# Altium project Yukitora_Mezanine.PrjPcb
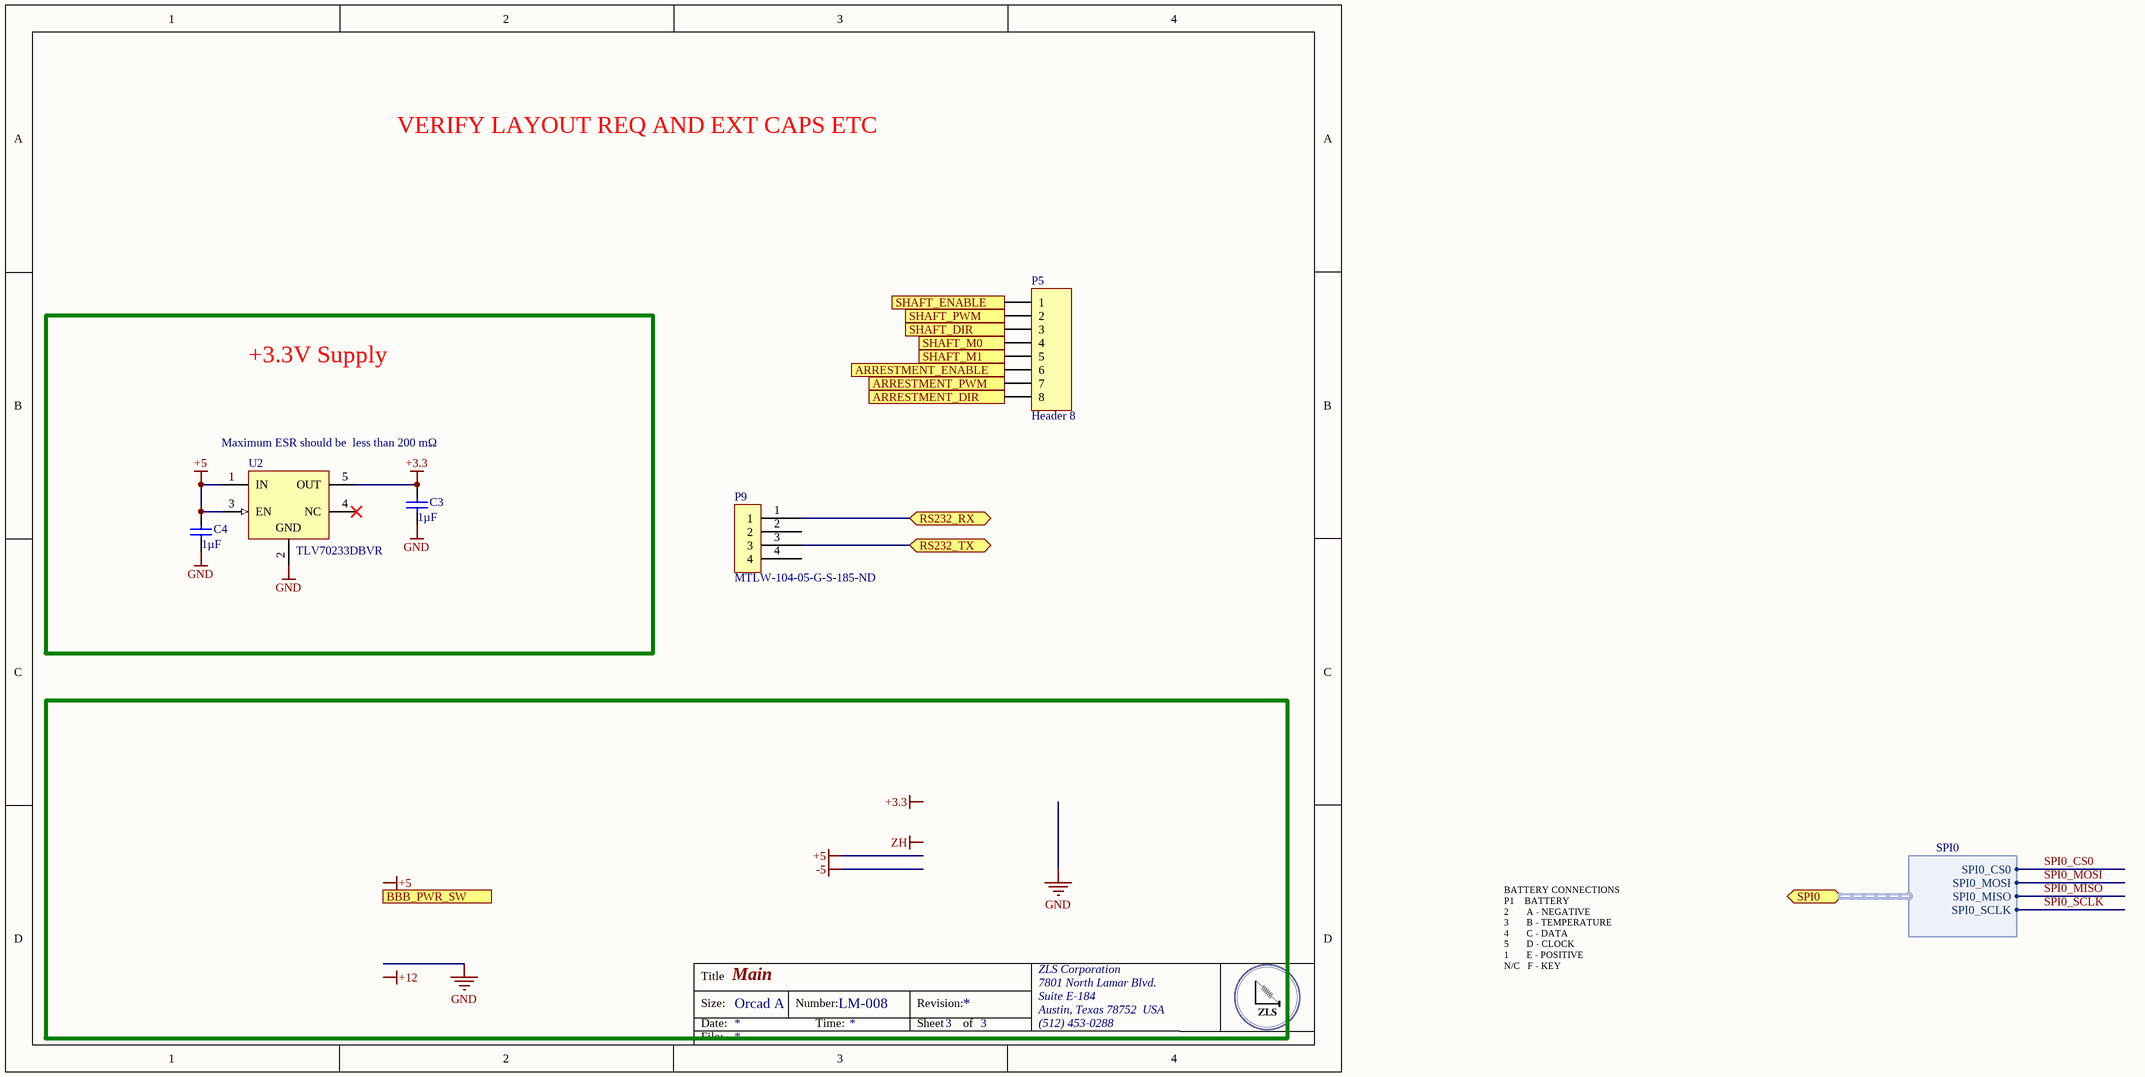
[diagram p0: Connectors.SchDoc]
6 sheets, 71 parts. Net scope: flat (ports and power ports of the same name join across sheets).
Board file: Yukitora_Mezanine.PcbDoc
Sheets:
  Connectors.SchDoc
  12_Supply.SchDoc
  Power_Input_FET.SchDoc
  5V_Supply_Alt_1.SchDoc
  Bluetooth.SchDoc
  Stepper Motor Driver.SchDoc

## Sheet Connectors.SchDoc: Main
size OrCAD A; DocumentNumber: LM-008; SheetNumber: 3; SheetTotal: 3; DocumentName: LM-008

### Parts
C3  Capacitance: 1µF  [CAPC1206(3216)130_N]  (hidden comment: CAP CER 1UF 50V X7R 1210)
C4  Capacitance: 1µF  [CAPC1206(3216)130_N]  (hidden comment: CAP CER 1UF 50V X7R 1210)
P5  Header 8  [HDR1X8]
P9  Supplier Part Number 1: MTLW-104-05-G-S-185-ND  [TLW-104-05-G-S]  (hidden comment: TLW-104-05-G-S)
U2  TLV70233DBVR  [DBV0005A_N]

### Blocks framed on the sheet
+3.3V Supply: C3 C4 U2

### Ports
ARRESTMENT_DIR, ARRESTMENT_ENABLE, ARRESTMENT_PWM, BBB_PWR_SW, RS232_RX, RS232_TX, SHAFT_DIR, SHAFT_ENABLE, SHAFT_M0, SHAFT_M1, SHAFT_PWM, SPI0 (harness SPI0)

### Harnesses
SPI0: SPI0_CS0, SPI0_MOSI, SPI0_MISO, SPI0_SCLK

### Nets
+3.3: C3.2 U2.5(OUT)
+5: C4.2 U2.1(IN) U2.3(EN)
GND: C3.1 C4.1 U2.2(GND)
RS232_RX: P9.1 ; port RS232_RX
RS232_TX: P9.3 ; port RS232_TX
SPI0_CS0: port SPI0.SPI0_CS0
SPI0_MISO: port SPI0.SPI0_MISO
SPI0_MOSI: port SPI0.SPI0_MOSI
SPI0_SCLK: port SPI0.SPI0_SCLK
NetP5_1: P5.1 ; port SHAFT_ENABLE
NetP5_2: P5.2 ; port SHAFT_PWM
NetP5_3: P5.3 ; port SHAFT_DIR
NetP5_4: P5.4 ; port SHAFT_M0
NetP5_5: P5.5 ; port SHAFT_M1
NetP5_6: P5.6 ; port ARRESTMENT_ENABLE
NetP5_7: P5.7 ; port ARRESTMENT_PWM
NetP5_8: P5.8 ; port ARRESTMENT_DIR

Not connected (* = marked no-connect by the designer): P9 2 4; U2 4(NC)*

### Notes on the sheet
- VERIFY LAYOUT REQ AND EXT CAPS ETC
- Maximum ESR should be  less than 200 mΩ
- BATTERY CONNECTIONS
  P1    BATTERY
  2       A - NEGATIVE
  3       B - TEMPERATURE
  4       C - DATA
  5       D - CLOCK
  1       E - POSITIVE
  N/C   F - KEY
- Labels drawn without touching a wire or pin: +3.3, +5, +12, ZH
- Title
- Size:
- Date:
- Orcad A
- Number:
- Time:
- Revision:
- Sheet
- of
- ZLS Corporation
- 7801 North Lamar Blvd.
- Suite E-184
- Austin, Texas 78752  USA
- (512) 453-0288
- File:

### Library data of the parts
C3 C4 = CMP-1037-04913-1: Manufacturer: Murata Electronics North America; Manufacturer Part Number: GRM32RR71H105KA01L; Tolerance: ±10%; Supplier 1: Digi-Key; Supplier Part Number 1: 490-1863-6-ND; RoHS: RoHS Compliant; Category: Capacitors; Stock 1: 66890; Pricing 1: 1=0.35, 10=0.242, 100=0.1449, 500=0.10868 (USD); Packaging: Digi-Reel®; Part Status: Active; Voltage - Rated: 50V; Temperature Coefficient: X7R; Operating Temperature: -55°C ~ 125°C; Features: -; Ratings: -; Applications: General Purpose; Mounting Type: Surface Mount, MLCC; Package / Case: 1210 (3225 Metric); Size / Dimension: 0.126" L x 0.098" W (3.20mm x 2.50mm); Height - Seated (Max): -; Thickness (Max): 0.079" (2.00mm); Lead Spacing: -; Lead Style: -; ComponentLink1URL: http://search.murata.co.jp/Ceramy/image/img/A01X/G101/ENG/GRM32RR71H105KA01-01.pdf; ComponentLink1Description: http://search.murata.co.jp/Ceramy/image/img/A01X/G101/ENG/GRM32RR71H105KA01-01.pdf
P5 = Header 8: Header, 8-Pin; LatestRevisionDate: 17-Jul-2002; LatestRevisionNote: Re-released for DXP Platform.; Publisher: Altium Limited
U2 = CMP-0394-00528-2: Single Output LDO, 300 mA, Fixed 3.3 V Output, 2 to 5.5 V Input, with Low IQ, 5-pin SOT-23 (DBV), -40 to 125 degC, Green (RoHS & no Sb/Br); Manufacturer: Texas Instruments; Vout Adj(Max)(V): 3.3; Vin(Max)(V): 5.5; SubFamily: Single Channel LDO; Iq(Typ)(mA): 0.03; Iout(Max)(A): 0.3; Vin(Min)(V): 2; Vdo(Typ)(mV): 220; Vout Adj(Min)(V): 3.3; Eco-Plan: Green (RoHS & no Sb/Br); PackageVersion: 4073253-4/K; ComponentLink1Description: Manufacturer URL; DatasheetVersion: SLVSAG6B; ComponentLink2Description: Datasheet; ComponentLink3URL: http://www.ti.com/litv/pdf/mpds018i; ComponentLink2URL: http://www.ti.com/general/docs/lit/getliterature.tsp?genericPartNumber=TLV70233&fileType=pdf; PackageReference: DBV0005A; ComponentLink1URL: http://www.ti.com/; Mounting Technology: Surface Mount; ComponentLink3Description: Package Specification; PackageDescription: 5-Pin Plastic Small Outline, Body 1.60 Ãƒâ€” 2.90 mm, Pitch 0.95 mm; Code_JEDEC: MO-178; Fixed Output Options(V): 3.3; PartNumber: TLV70233DBVR; Accuracy(%): 2
P9 = TLW-104-05-G-S: Supplier 1: Digi-Key

## Sheet 12_Supply.SchDoc: 12V Supply
size OrCAD A; DocumentNumber: YT-002; Revision: -
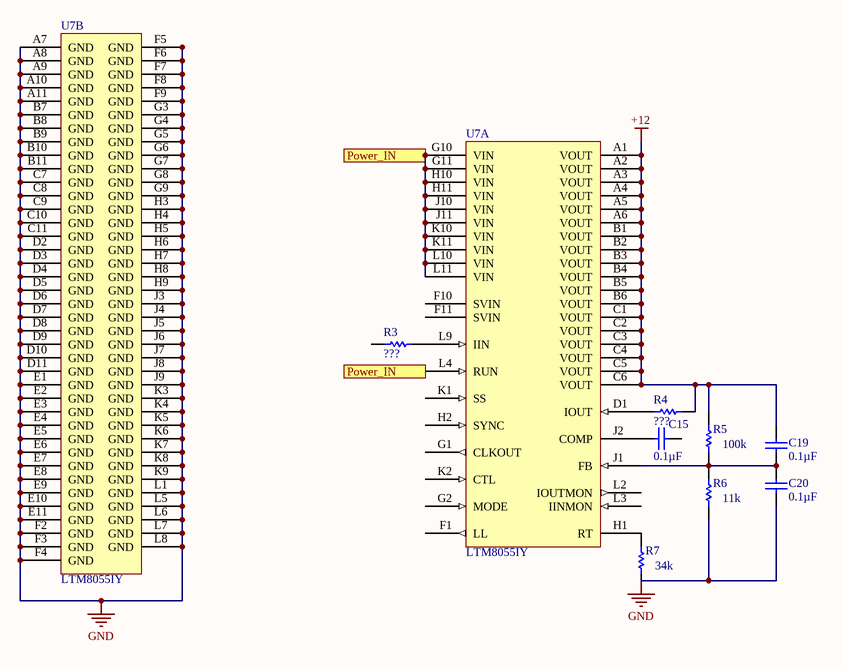
[diagram p1: 12_Supply.SchDoc]

### Parts
C15  Capacitance: 0.1µF  [CAPC0805(2012)145_N]  (hidden comment: CAP CER 0.1UF 16V X7R 0805)
C19  Capacitance: 0.1µF  [CAPC0805(2012)145_N]  (hidden comment: CAP CER 0.1UF 16V X7R 0805)
C20  Capacitance: 0.1µF  [CAPC0805(2012)145_N]  (hidden comment: CAP CER 0.1UF 16V X7R 0805)
R3  ???  [RESC0402(1005)_L]
R4  ???  [RESC0402(1005)_L]
R5  100k  [RESC0402(1005)_L]
R6  11k  [RESC0402(1005)_L]
R7  34k  [RESC0402(1005)_L]
U7  LTM8055IY  [LT-BGA-121-15000X15000X4920]  (parts A,B of 2)

### Ports
Power_IN

### Nets
+12: C19.2 R4.1 R5.2 U7.A1(VOUT) U7.A2(VOUT) U7.A3(VOUT) U7.A4(VOUT) U7.A5(VOUT) U7.A6(VOUT) U7.B1(VOUT) U7.B2(VOUT) U7.B3(VOUT) U7.B4(VOUT) U7.B5(VOUT) U7.B6(VOUT) U7.C1(VOUT) U7.C2(VOUT) U7.C3(VOUT) U7.C4(VOUT) U7.C5(VOUT) U7.C6(VOUT)
GND: C20.1 R6.1 U7.A7(GND) U7.A8(GND) U7.A9(GND) U7.A10(GND) U7.A11(GND) U7.B7(GND) U7.B8(GND) U7.B9(GND) U7.B10(GND) U7.B11(GND) U7.C7(GND) U7.C8(GND) U7.C9(GND) U7.C10(GND) U7.C11(GND) U7.D2(GND) U7.D3(GND) U7.D4(GND) U7.D5(GND) U7.D6(GND) U7.D7(GND) U7.D8(GND) U7.D9(GND) U7.D10(GND) U7.D11(GND) U7.E1(GND) U7.E2(GND) U7.E3(GND) U7.E4(GND) U7.E5(GND) U7.E6(GND) U7.E7(GND) U7.E8(GND) U7.E9(GND) U7.E10(GND) U7.E11(GND) U7.F2(GND) U7.F3(GND) U7.F4(GND) U7.F5(GND) U7.F6(GND) U7.F7(GND) U7.F8(GND) U7.F9(GND) U7.G3(GND) U7.G4(GND) U7.G5(GND) U7.G6(GND) U7.G7(GND) U7.G8(GND) U7.G9(GND) U7.H3(GND) U7.H4(GND) U7.H5(GND) U7.H6(GND) U7.H7(GND) U7.H8(GND) U7.H9(GND) U7.J3(GND) U7.J4(GND) U7.J5(GND) U7.J6(GND) U7.J7(GND) U7.J8(GND) U7.J9(GND) U7.K3(GND) U7.K4(GND) U7.K5(GND) U7.K6(GND) U7.K7(GND) U7.K8(GND) U7.K9(GND) U7.L1(GND) U7.L5(GND) U7.L6(GND) U7.L7(GND) U7.L8(GND)
Power_IN: U7.G10(VIN) U7.G11(VIN) U7.H10(VIN) U7.H11(VIN) U7.J10(VIN) U7.J11(VIN) U7.K10(VIN) U7.K11(VIN) U7.L4(RUN) U7.L10(VIN) U7.L11(VIN) ; port Power_IN
NetC15_1: C15.1 U7.J2(COMP)
NetC19_1: C19.1 C20.2 R5.1 R6.2 U7.J1(FB)
NetR3_1: R3.1 U7.L9(IIN)
NetR4_2: R4.2 U7.D1(IOUT)
NetR7_2: R7.2 U7.H1(RT)

Not connected (* = marked no-connect by the designer): C15 2; R3 2; R7 1; U7 F1(LL) F10(SVIN) F11(SVIN) G1(CLKOUT) G2(MODE) H2(SYNC) K1(SS) K2(CTL) L2(IOUTMON) L3(IINMON)

### Notes on the sheet
- Title
- Size:
- Date:
- Orcad A
- Number:
- Time:
- Revision:
- Sheet
- of
- ZLS Corporation
- 7801 North Lamar Blvd.
- Suite E-184
- Austin, Texas 78752  USA
- (512) 453-0288
- File:

### Library data of the parts
C15 C19 C20 = CMP-1036-04795-1: Manufacturer: Murata Electronics North America; Manufacturer Part Number: GRM219R71C104KA01D; Tolerance: ±10%; Voltage - Rated: 25V; Supplier Part Number 1: 490-1673-6-ND; Temperature Coefficient: X7R; Thickness (Max): 0.053" (1.35mm); Supplier 2: Digi-Key; Supplier Part Number 2: 490-1683-6-ND; RoHS: RoHS Compliant; Category: Capacitors; Stock 2: 245331; Pricing 2: 1=0.14, 10=0.098, 100=0.0462, 500=0.0324, 1000=0.02683 (USD); Packaging: Digi-Reel®; Part Status: Active; Operating Temperature: -55°C ~ 125°C; Features: -; Ratings: -; Applications: General Purpose; Mounting Type: Surface Mount, MLCC; Package / Case: 0805 (2012 Metric); Size / Dimension: 0.079" L x 0.049" W (2.00mm x 1.25mm); Height - Seated (Max): -; Lead Spacing: -; Lead Style: -; ComponentLink1URL: http://www.murata.com/~/media/webrenewal/support/library/catalog/products/capacitor/mlcc/c02e.ashx; ComponentLink1Description: http://www.murata.com/~/media/webrenewal/support/library/catalog/products/capacitor/mlcc/c02e.ashx
R3-R7 = CMP-1011-00927-1: Tolerance: ±1%; Temperature Coefficient: ±100ppm/°C; Supplier Part Number 1: YAG3220CT-ND; Supplier Device Package: 0402
U7 = CMP-2000-06614-1: Buck-Boost uModule Regulator, 8.5 A, 5 to 36 V, -40 to 125 degC, 121-Ball BGA, RoHS, Tray; Manufacturer: LinearTechnology; Current - Output (Max): 8.5A; Number of Outputs: 1; Efficiency: 97.5%; Voltage - Input (Max): 36V; Package Version: Rev. A, 11/2012; Voltage - Output 1: 1.2~36V; Voltage - Input (Min): 5V; Operating Temperature: -40°C~125°C; Voltage - Output 3: -; Datasheet Version: Rev. A, 01/2016; Power (Watts) - Manufacture Series: -; Series: µModule®; Manufacturer URL: http://www.linear.com/; Datasheet URL: http://cds.linear.com/docs/en/datasheet/8055fa.pdf; Type: Non-IsolatedPoLModule; Voltage - Output 2: -; Mounting Type: SurfaceMount; Packaging: Tray; Mounting Technology: SurfaceMount; Package URL: http://www.linear.com/docs/41075; Features: OTP; Power (Watts) - Max: -; Package Reference: BGA-121; Category: PowerSupplies-BoardMount; Package / Case: 121-BGA; Voltage - Isolation: -; Package Description: 121-Ball BGA, Body 15 x 15 mm, Pitch 1.27 mm; Applications: ITE(Commercial); Family: DCDCConverters; PartId: 1

## Sheet Power_Input_FET.SchDoc: Power Input
size OrCAD A; CompanyName: ZLS; DocumentNumber: LM-008; Revision: F
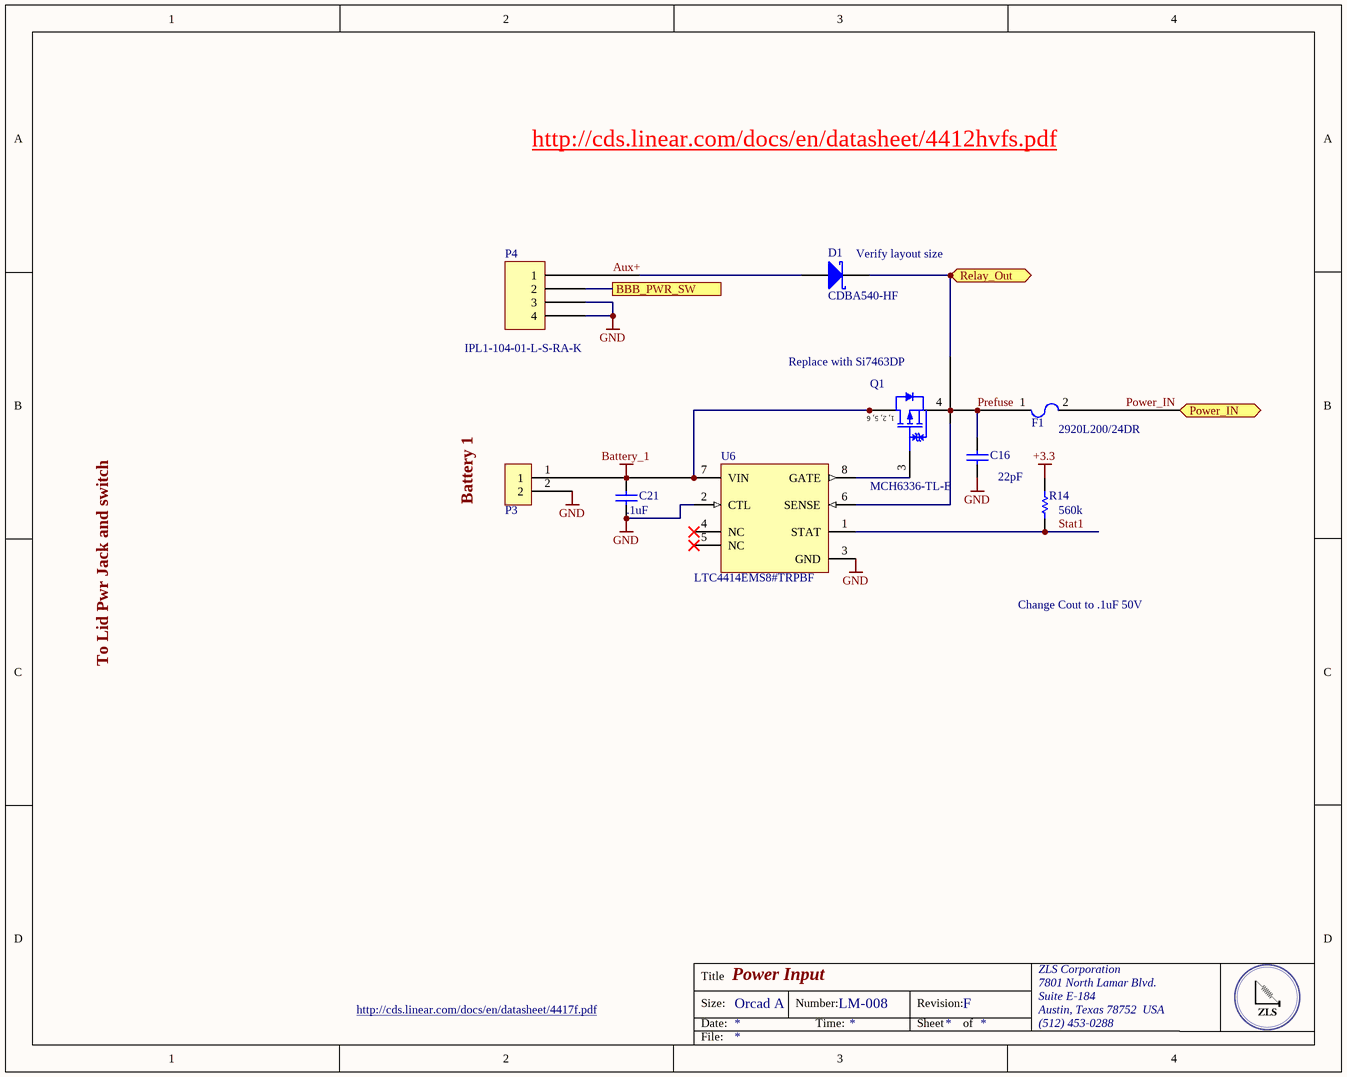
[diagram p2: Power_Input_FET.SchDoc]

### Parts
C16  Capacitance: 22pF  [CAPC1206(3216)130_N]  (hidden comment: CAP CER 10UF 6.3V X5R 1206)
C21  Capacitance: .1uF  [CAPC1206(3216)130_N]  (hidden comment: CAP CER 10UF 6.3V X5R 1206)
D1  CDBA540-HF  [VISH-DO-214AC-2_M]
F1  PCT  [CAPC7451X12N]  (value not drawn)
P3  IPL1-102-01-F-S-RA-K  [IPL1-102-01-F-S-RA-K]  (value not drawn)
P4  IPL1-104-01-L-S-RA-K  [IPL1-104-01-L-S-RA-K]
Q1  MCH6336-TL-E  [ONSC-MCPH-6_V]
R14  560k  [RESC0402(1005)_L]
U6  LTC4414EMS8#TRPBF  [LT-MS8-8_L]

### Ports
BBB_PWR_SW, Power_IN, Relay_Out

### Nets
+3.3: R14.2
Battery_1: C21.2 P3.1 Q1.1(D) Q1.2(D) Q1.5(D) Q1.6(D) U6.7(VIN)
GND: C16.1 C21.1 P3.2 P4.3 P4.4 U6.2(CTL) U6.3(GND)
Aux+: D1.1(A) P4.1
Power_IN: F1.2 ; port Power_IN
Prefuse: C16.2 D1.2(K) F1.1 Q1.4(S) U6.6(SENSE) ; port Relay_Out
Stat1: R14.1 U6.1(STAT)
NetP4_2: P4.2 ; port BBB_PWR_SW
NetQ1_3: Q1.3(G) U6.8(GATE)

Not connected (* = marked no-connect by the designer): U6 4(NC)* 5(NC)*

### Notes on the sheet
- http://cds.linear.com/docs/en/datasheet/4412hvfs.pdf
- (near D1) Verify layout size
- (near Q1) Replace with Si7463DP
- (near F1) 2920L200/24DR
- Battery 1
- Change Cout to .1uF 50V
- To Lid Pwr Jack and switch
- http://cds.linear.com/docs/en/datasheet/4417f.pdf
- Title
- Size:
- Date:
- Orcad A
- Number:
- Time:
- Revision:
- Sheet
- of
- ZLS Corporation
- 7801 North Lamar Blvd.
- Suite E-184
- Austin, Texas 78752  USA
- (512) 453-0288
- File:
- (in symbol CMP-1058-00598-1) 1, 2, 5, 6

### Library data of the parts
C16 C21 = CMP-1037-04913-1: Manufacturer: Taiyo Yuden; Manufacturer Part Number: JMK316BJ106ML-T; Tolerance: ±20%; Notification: Current market demand for these product types have resulted in fluctuating and extending lead times. Lead times may differ.; Supplier 1: Digi-Key; Supplier Part Number 1: 587-5447-1-ND; RoHS: RoHS Compliant; Category: Capacitors; Stock 1: 5600; Pricing 1: 1=0.24, 10=0.161, 100=0.0817, 500=0.05592, 1000=0.04946 (USD); Packaging: Cut Tape (CT); Part Status: Active; Voltage - Rated: 6.3V; Temperature Coefficient: X5R; Operating Temperature: -55°C ~ 85°C; Features: -; Ratings: -; Applications: SMPS Filtering; Failure Rate: -; Mounting Type: Surface Mount, MLCC; Package / Case: 1206 (3216 Metric); Size / Dimension: 0.126" L x 0.063" W (3.20mm x 1.60mm); Height - Seated (Max): -; Thickness (Max): 0.071" (1.80mm); Lead Spacing: -; Lead Style: -; ComponentLink1URL: http://ds.yuden.co.jp/TYCOMPAS/ut/detail.do?productNo=JMK316BJ106ML-T&fileName=JMK316BJ106ML-T_SS&mode=specSheetDownload; ComponentLink1Description: http://ds.yuden.co.jp/TYCOMPAS/ut/detail.do?productNo=JMK316BJ106ML-T&fileName=JMK316BJ106ML-T_SS&mode=specSheetDownload
D1 = D Schottky: DIODE SCHOTTKY 40V 5A DO214AB; Manufacturer: Comchip Technology; Speed: Fast Recovery =< 500ns, > 200mA (Io); Capacitance @ Vr, F: 380pF @ 4V, 1MHz; Supplier 1: Digi-Key; Supplier Part Number 1: 641-1707-6-ND; Manufacturer Part Number: CDBA540-HF; RoHS: RoHS Compliant; Category: Discrete Semiconductor Products; Stock 1: 7367; Pricing 1: 1=0.49, 10=0.381, 25=0.3208, 100=0.2612, 250=0.2164, 500=0.1791, 1000=0.13432, 2500=0.12313 (USD); Packaging: Digi-Reel®; Part Status: Active; Diode Type: Schottky; Current - Average Rectified (Io): 5A; Mounting Type: Surface Mount; Package / Case: DO-214AC, SMA; Supplier Device Package: DO-214AC (SMA); Operating Temperature - Junction: -50°C ~ 150°C; ComponentLink1URL: http://www.comchiptech.com/cms/UserFiles/CDBA540-HF%20Thru505315.%20CDBA5200-HF%20RevC.pdf; ComponentLink1Description: http://www.comchiptech.com/cms/UserFiles/CDBA540-HF%20Thru505315.%20CDBA5200-HF%20RevC.pdf
P4 = IPL1-104-01-L-S-RA-K: Manufacturer: Samtec Inc.; Connector Type: Header; Pitch - Mating: 0.100" (2.54mm); Number of Positions: 4; Number of Positions Loaded: All; Style: Board to Cable/Wire; Shrouding: Shrouded - 4 Wall; Contact Length - Mating: 0.215" (5.46mm); Contact Length - Post: 0.085" (2.16mm); Material Flammability Rating: UL94 V-0; Voltage Rating: 675VAC, 954VDC; Supplier 1: Digi-Key; Supplier Part Number 1: SAM9597-ND; Manufacturer Part Number: IPL1-104-01-L-S-RA-K; RoHS: RoHS Compliant; Category: Connectors, Interconnects; Stock 1: 265; Pricing 1: 1=2.53, 10=2.424, 100=2.02, 500=1.717, 1000=1.4645, 5000=1.313 (USD); Packaging: Tube; Part Status: Active; Contact Type: Male Pin; Number of Rows: 1; Row Spacing - Mating: -; Mounting Type: Through Hole, Right Angle; Termination: Solder; Fastening Type: Locking Ramp; Overall Contact Length: -; Insulation Height: 0.240" (6.10mm); Contact Shape: Square; Contact Finish - Mating: Gold; Contact Finish Thickness - Mating: 10µin (0.25µm); Contact Finish - Post: Tin; Contact Material: Phosphor Bronze; Insulation Material: Liquid Crystal Polymer (LCP); Features: -; Operating Temperature: -55°C ~ 125°C; Ingress Protection: -; Insulation Color: Natural; Current Rating: -; Mated Stacking Heights: -; Contact Finish Thickness - Post: -; Applications: -; ComponentLink1URL: http://suddendocs.samtec.com/prints/ipl1-1xx-xx-xxx-s-xx-x-xx-mkt.pdf; ComponentLink1Description: http://suddendocs.samtec.com/prints/ipl1-1xx-xx-xxx-s-xx-x-xx-mkt.pdf
Q1 = CMP-1058-00598-1: P-Channel Power MOSFET, -12 V, -5 A, 43 mOhm, Single, 6-Pin MCPH, Pb-Free, Tape and Reel; Manufacturer: On Semiconductor; Channel Polarity: P Channel; VGS(th) Max (V): 1.4; Ciss Typ (pF): 660; V(BR)DSS Min (V): 12; VGS Max (V): 10; Crss Typ (pF): 155; Coss Typ (pF): 210; PD Max (W): 1.5; ID Max (A): 5; Package Type: SC-88FL / MCPH-6; ComponentLink2URL: http://www.onsemi.cn/pub_link/Collateral/MCH6336-D.PDF; ComponentLink3URL: http://www.onsemi.com/pub_link/Collateral/ENA1601-D.PDF; RoHS: Pb-Free; Mounting Technology: Surface Mount; PartNumber: MCH6336-TL-E; ComponentLink2Description: Datasheet; ComponentLink1URL: http://www.onsemi.com/; ComponentLink1Description: Manufacturer URL; Configuration: Single; ComponentLink3Description: Package Specification; Packing: Tape and Reel; PackageDescription: 6-Pin Small Outline Transistor, Body 2 x 1.6 mm, Pitch 0.65 mm; PackageReference: MCPH-6
R14 = CMP-1011-00927-1: as R3 on sheet 12_Supply; Supplier Part Number 1: YAG3220CT-ND; Supplier Device Package: 0402
U6 = CMP-0479-00214-1: Low Loss PowerPath Controller for Large PFET, 3 to 36 V Vin, 8-pin SOP (MS8-8), -40 to 85 degC, Pb-Free, Tape and Reel; Manufacturer: Linear Technology; Ideal Diode: Single, External, P-Channel; ComponentLink3URL: http://cds.linear.com/docs/en/packaging/05081660_G_MS8.pdf; DatasheetVersion: Rev. C; ComponentLink2Description: Datasheet; ComponentLink1Description: Manufacturer URL; ComponentLink2URL: http://cds.linear.com/docs/en/datasheet/4414fc.pdf; ComponentLink3Description: Package Specification; ComponentLink1URL: http://www.linear.com/; Packing: Tape and Reel; Mounting Technology: Surface Mount; PackageDescription: 8-Pin Plastic MSOP, Body 3 x 3 mm, Pitch 0.65 mm; PackageVersion: Rev. G, 03/2012; PackageReference: MS8-8; PartNumber: LTC4414EMS8#TRPBF; RoHS: TRUE

## Sheet 5V_Supply_Alt_1.SchDoc
size OrCAD A
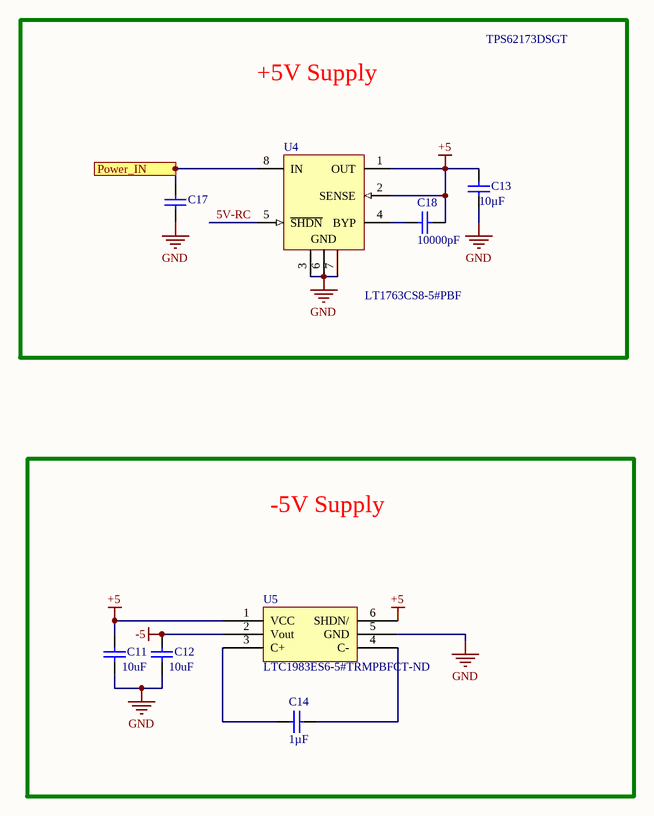
[diagram p3: 5V_Supply_Alt_1.SchDoc]

### Parts
C11  Capacitance: 10uF  [CAPC1206(3216)130_N]  (hidden comment: CAP CER 10UF 6.3V X5R 1206)
C12  Capacitance: 10uF  [CAPC1206(3216)130_N]  (hidden comment: CAP CER 10UF 6.3V X5R 1206)
C13  Capacitance: 10µF  [CAPC1206(3216)130_N]  (hidden comment: CAP CER 1UF 50V X7R 1210)
C14  Capacitance: 1µF  [CAPC1206(3216)130_N]  (hidden comment: CAP CER 1UF 10V X5R 0805)
C17  1uF  [CAPC1206(3216)130_N]  (value not drawn)
C18  Capacitance: 10000pF  [CAPC1206(3216)130_N]  (hidden comment: CAP CER 1UF 50V X7R 1210)
U4  LT1763CS8-5#PBF  [LT-S8-8_M]
U5  Supplier Part Number 1: LTC1983ES6-5#TRMPBFCT-ND  [SOT95P323X100-6N]  (hidden comment: LTC1983ES6-5#TRMPBF)

### Blocks framed on the sheet
+5V Supply: C13 C17 C18 U4
-5V Supply: C11 C12 C14 U5

### Ports
Power_IN

### Nets
+5: C11.2 C13.2 C18.1 U4.1(OUT) U4.2(SENSE) U5.1(VCC) U5.6(SHDN/)
-5: C12.2 U5.2(Vout)
GND: C11.1 C12.1 C13.1 C17.1 U4.3(GND) U4.6(GND) U4.7(GND) U5.5(GND)
5V-RC: U4.5(~{SHDN})
Power_IN: C17.2 U4.8(IN) ; port Power_IN
NetC14_1: C14.1 U5.4(C-)
NetC14_2: C14.2 U5.3(C+)
NetC18_2: C18.2 U4.4(BYP)

### Notes on the sheet
- TPS62173DSGT
- Title
- Size:
- Date:
- Orcad A
- Number:
- Time:
- Revision:
- Sheet
- of
- ZLS Corporation
- 7801 North Lamar Blvd.
- Suite E-184
- Austin, Texas 78752  USA
- (512) 453-0288
- File:

### Library data of the parts
C11 C12 = CMP-1037-04913-1: as C16 on sheet Power_Input_FET; Supplier 1: Digi-Key; Supplier Part Number 1: 587-5447-1-ND; RoHS: RoHS Compliant; Category: Capacitors; Stock 1: 5600; Pricing 1: 1=0.24, 10=0.161, 100=0.0817, 500=0.05592, 1000=0.04946 (USD); Packaging: Cut Tape (CT); Part Status: Active; Voltage - Rated: 6.3V; Temperature Coefficient: X5R; Operating Temperature: -55°C ~ 85°C; Features: -; Ratings: -; Applications: SMPS Filtering; Failure Rate: -; Mounting Type: Surface Mount, MLCC; Package / Case: 1206 (3216 Metric); Size / Dimension: 0.126" L x 0.063" W (3.20mm x 1.60mm); Height - Seated (Max): -; Thickness (Max): 0.071" (1.80mm); Lead Spacing: -; Lead Style: -; ComponentLink1URL: http://ds.yuden.co.jp/TYCOMPAS/ut/detail.do?productNo=JMK316BJ106ML-T&fileName=JMK316BJ106ML-T_SS&mode=specSheetDownload; ComponentLink1Description: http://ds.yuden.co.jp/TYCOMPAS/ut/detail.do?productNo=JMK316BJ106ML-T&fileName=JMK316BJ106ML-T_SS&mode=specSheetDownload
C13 C18 = CMP-1037-04913-1: as C3 on sheet Connectors; Supplier 1: Digi-Key; Supplier Part Number 1: 490-1863-6-ND; RoHS: RoHS Compliant; Category: Capacitors; Stock 1: 66890; Pricing 1: 1=0.35, 10=0.242, 100=0.1449, 500=0.10868 (USD); Packaging: Digi-Reel®; Part Status: Active; Voltage - Rated: 50V; Temperature Coefficient: X7R; Operating Temperature: -55°C ~ 125°C; Features: -; Ratings: -; Applications: General Purpose; Mounting Type: Surface Mount, MLCC; Package / Case: 1210 (3225 Metric); Size / Dimension: 0.126" L x 0.098" W (3.20mm x 2.50mm); Height - Seated (Max): -; Thickness (Max): 0.079" (2.00mm); Lead Spacing: -; Lead Style: -; ComponentLink1URL: http://search.murata.co.jp/Ceramy/image/img/A01X/G101/ENG/GRM32RR71H105KA01-01.pdf; ComponentLink1Description: http://search.murata.co.jp/Ceramy/image/img/A01X/G101/ENG/GRM32RR71H105KA01-01.pdf
C14 = CMP-1037-04913-1: Manufacturer: Taiyo Yuden; Manufacturer Part Number: LMK212BJ105MD-T; Tolerance: ±20%; Notification: Current market demand for these product types have resulted in fluctuating and extending lead times. Lead times may differ.; Supplier 1: Digi-Key; Supplier Part Number 1: 587-4918-1-ND; RoHS: RoHS Compliant; Category: Capacitors; Stock 1: 2994; Pricing 1: 1=0.17, 10=0.121, 100=0.0567, 500=0.03976, 1000=0.03291 (USD); Packaging: Cut Tape (CT); Part Status: Active; Voltage - Rated: 10V; Temperature Coefficient: X5R; Operating Temperature: -55°C ~ 85°C; Features: -; Ratings: -; Applications: SMPS Filtering; Failure Rate: -; Mounting Type: Surface Mount, MLCC; Package / Case: 0805 (2012 Metric); Size / Dimension: 0.079" L x 0.049" W (2.00mm x 1.25mm); Height - Seated (Max): -; Thickness (Max): 0.037" (0.95mm); Lead Spacing: -; Lead Style: -; ComponentLink1URL: http://ds.yuden.co.jp/TYCOMPAS/ut/detail.do?productNo=LMK212BJ105MD-T&fileName=LMK212BJ105MD-T_SS&mode=specSheetDownload; ComponentLink1Description: http://ds.yuden.co.jp/TYCOMPAS/ut/detail.do?productNo=LMK212BJ105MD-T&fileName=LMK212BJ105MD-T_SS&mode=specSheetDownload
C17 = CMP-1037-04913-1
U4 = CMP-0476-01685-1: 500 mA, Low Noise, LDO Micropower Regulator, 1.8 to 20 V Vin, 5 V Vout, 8-pin SOIC (S8-8), -40 to 125 degC, Pb-Free; Manufacturer: Linear Technology; Output Voltage: 5 V; Vin Min(V): 1.8; Discrete Pass Element: no; Number of Outputs: 1; Dropout Voltage(V): 0.3; Vin Max(V): 20; PSRR(dB): 65; Iout(mA): 500; Isupply(mA): 0.03; Mounting Technology: Surface Mount; ComponentLink3Description: Package Specification; PartNumber: LT1763CS8-5#PBF; PackageDescription: 8-Pin Plastic Small Outline (Narrow .150 Inch), Body 4.9 x 3.9 mm, Pitch 1.27 mm; DatasheetVersion: Rev. G; ComponentLink2URL: http://cds.linear.com/docs/en/datasheet/1763fg.pdf; PackageReference: S8-8; ComponentLink1URL: http://www.linear.com/; ComponentLink2Description: Datasheet; ComponentLink1Description: Manufacturer URL; PackageVersion: Rev. G, 03/2012; Shutdown Current(uA): 1; ComponentLink3URL: http://cds.linear.com/docs/en/packaging/05081610_G_SO8.pdf; RoHS: TRUE; Noise(uV): 20
U5 = LTC1983ES6-5#TRMPBF: Manufacturer: Linear Technology/Analog Devices; Function: Step-Down; Output Configuration: Negative; Topology: Charge Pump; Output Type: Fixed; Number of Outputs: 1; Voltage - Input (Min): 2.3V; Voltage - Input (Max): 5.5V; Voltage - Output (Min/Fixed): -5V; Current - Output: 100mA; Frequency - Switching: 900kHz; Synchronous Rectifier: No; Supplier 1: Digi-Key; Manufacturer Part Number: LTC1983ES6-5#TRMPBF; RoHS: RoHS Compliant; Category: Integrated Circuits (ICs); Stock 1: 17516; Pricing 1: 1=4.36, 25=3.8952, 100=2.3256, 250=2.1318 (USD); Packaging: Cut Tape (CT); Part Status: Active; Voltage - Output (Max): -; Operating Temperature: -40°C ~ 85°C (TA); Mounting Type: Surface Mount; Package / Case: SOT-23-6 Thin, TSOT-23-6; Supplier Device Package: TSOT-23-6; Base Part Number: LTC1983-5; ComponentLink1URL: http://www.linear.com/docs/2135; ComponentLink1Description: http://www.linear.com/docs/2135

## Sheet Bluetooth.SchDoc: Bluetooth
size OrCAD A; DocumentNumber: LM-004; Revision: C; SheetNumber: 4; SheetTotal: 4
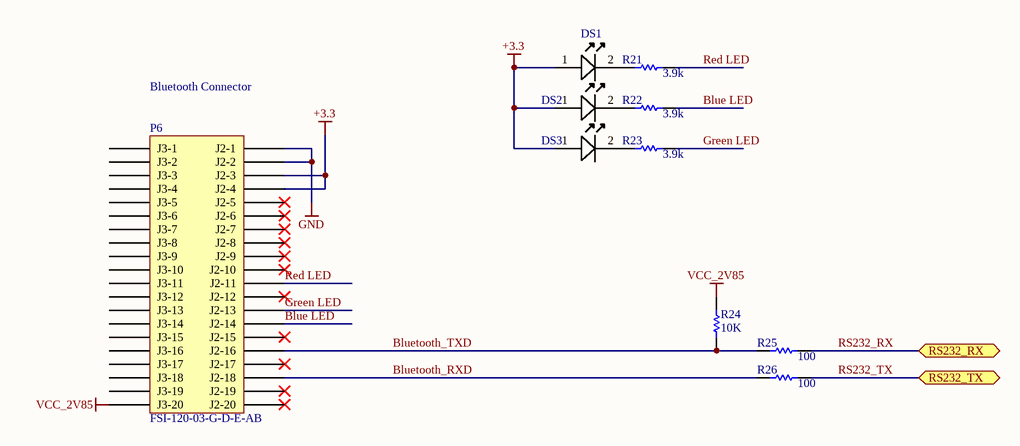
[diagram p4: Bluetooth.SchDoc]

### Parts
DS1  Lite-On LTST-S220KGKT Green LED, 571 nm 2012 (0805) Side View, Rectangle Lens SMD package  [0805C_L]  (value not drawn)
DS2  Lite-On LTST-S220KGKT Green LED, 571 nm 2012 (0805) Side View, Rectangle Lens SMD package  [0805C_L]  (value not drawn)
DS3  Lite-On LTST-S220KGKT Green LED, 571 nm 2012 (0805) Side View, Rectangle Lens SMD package  [0805C_L]  (value not drawn)
P6  FSI-120-03-G-D-E-AB  [FSI-120-03-G-D-E-AB]
R21  3.9k  [RESC0805(2012)_L]
R22  3.9k  [RESC0805(2012)_L]
R23  3.9k  [RESC0805(2012)_L]
R24  10K  [RESC0805(2012)_L]
R25  100  [RESC0805(2012)_L]
R26  100  [RESC0805(2012)_L]

### Ports
RS232_RX, RS232_TX

### Nets
+3.3: DS1.1(A) DS2.1(A) DS3.1(A) P6.J2-3 P6.J2-4
GND: P6.J2-1 P6.J2-2
VCC_2V85: P6.J3-20 R24.1
Blue LED: P6.J2-14 R22.1
Bluetooth_RXD: P6.J2-18 R26.2
Bluetooth_TXD: P6.J2-16 R24.2 R25.2
Green LED: P6.J2-13 R23.1
Red LED: P6.J2-11 R21.1
RS232_RX: R25.1 ; port RS232_RX
RS232_TX: R26.1 ; port RS232_TX
NetDS1_2: DS1.2(K) R21.2
NetDS2_2: DS2.2(K) R22.2
NetDS3_2: DS3.2(K) R23.2

Not connected (* = marked no-connect by the designer): P6 J2-5* J2-6* J2-7* J2-8* J2-9* J2-10* J2-12* J2-15* J2-17* J2-19* J2-20* J3-1 J3-2 J3-3 J3-4 J3-5 J3-6 J3-7 J3-8 J3-9 J3-10 J3-11 J3-12 J3-13 J3-14 J3-15 J3-16 J3-17 J3-18 J3-19

### Notes on the sheet
- Bluetooth Connector
- Title
- Size:
- Date:
- Orcad A
- Number:
- Time:
- Revision:
- Sheet
- of
- ZLS Corporation
- 7801 North Lamar Blvd.
- Suite E-184
- Austin, Texas 78752  USA
- (512) 453-0288
- File:

### Library data of the parts
DS1-DS3 = LED A/K: Manufacturer: Vishay / Lite-On; Lens Colour: Colorless; Viewing Angle: 130°; Luminous Intensity: 35mcd; Forward Current: 20mA; Forward Voltage: 2V; Lens Style: Diffused,Colorless; Power Rating: 75mW; Dominant Wavelength: 568nm; Lens Transparency: Clear; Number of Elements: 1; Power Dissipation: 75W; Wavelength: 574nm; Supplier 1: Digi-Key; Supplier Part Number 1: 160-1468-1-ND; Manufacturer Part Number: LTST-S220KGKT; Stock 1: 74800; Pricing 1: 1=0.29, 10=0.212, 25=0.1564, 100=0.1117, 250=0.0759, 500=0.067, 1000=0.0525 (USD); Mount: Surface Mount; Case/Package: 0805; Number of Pins: 2; Colour: Green; Case Code (Metric): 2012; Case Code (Imperial): 0805; Min Operating Temperature: -55°C; Max Operating Temperature: 85°C; Packaging: Tape and Reel; Package Quantity: 4000; Illumination Colour: Green; Test Current: 20mA; Number of LEDs: 1; Length: 2.1mm; Height: 0.6mm; Width: 1mm; Depth: 0.6mm; Radiation Hardening: No; Lead Free: Lead Free; ComponentLink1URL: https://datasheet.ciiva.com/11775/0900766b80dc0b70-11775441.pdf; ComponentLink1Description: https://datasheet.ciiva.com/11775/0900766b80dc0b70-11775441.pdf; ComponentLink2URL: https://datasheet.ciiva.com/2110/s-110-ltst-s220kgkt-2110069.pdf; ComponentLink2Description: https://datasheet.ciiva.com/2110/s-110-ltst-s220kgkt-2110069.pdf; ComponentLink3URL: https://datasheet.ciiva.com/2110/s-110-ltst-s220kgkt-2110070.pdf; ComponentLink3Description: https://datasheet.ciiva.com/2110/s-110-ltst-s220kgkt-2110070.pdf; ComponentLink4URL: https://datasheet.ciiva.com/12400/100-ltst-s220kgkt-59602-12400886.pdf; ComponentLink4Description: https://datasheet.ciiva.com/12400/100-ltst-s220kgkt-59602-12400886.pdf; ComponentLink5URL: https://datasheet.ciiva.com/2110/s-110-ltst-s220kgkt-2110071.pdf; ComponentLink5Description: https://datasheet.ciiva.com/2110/s-110-ltst-s220kgkt-2110071.pdf; ComponentLink6URL: https://datasheet.ciiva.com/16379/ltst-s220kgkt-16379082.pdf; ComponentLink6Description: https://datasheet.ciiva.com/16379/ltst-s220kgkt-16379082.pdf; Supplier 2: Farnell; Supplier Part Number 2: 2062310; RoHS: YES; Stock 2: 2271; Pricing 2: 1=0.325, 10=0.317, 100=0.23, 200=0.228, 400=0.182, 900=0.147, 3000=0.114, 9000=0.107 (GBP); ComponentLink7URL: http://www.farnell.com/cad/2124774.pdf; ComponentLink7Description: http://www.farnell.com/cad/2124774.pdf; ComponentLink8URL: http://www.farnell.com/datasheets/693084.pdf; ComponentLink8Description: http://www.farnell.com/datasheets/693084.pdf
R21-R23 = CMP-1013-00215-1: 2R55 0.125W 1% 0805 (2012 Metric)  SMD; Case-Metric: 2012; Case-EIA: 0805; Value: 3.9k; Tolerance: 1 %; Technology: SMT; Power: 0.125 W
R24-R26 = CMP-1013-00215-1: 2R55 0.125W 1% 0805 (2012 Metric)  SMD; Case-Metric: 2012; Value: 3.9k; Case-EIA: 0805; Tolerance: 1 %; Technology: SMT; Power: 0.125 W
P6 = FSI-120-03-G-D-E-AB: Supplier 1: Avnet; Supplier Part Number 1: FSI-120-03-G-D-E-AB

## Sheet Stepper Motor Driver.SchDoc: Stepper Motor Driver
size Tabloid; DocumentNumber: LM-004; Revision: C; SheetNumber: 3; SheetTotal: 3
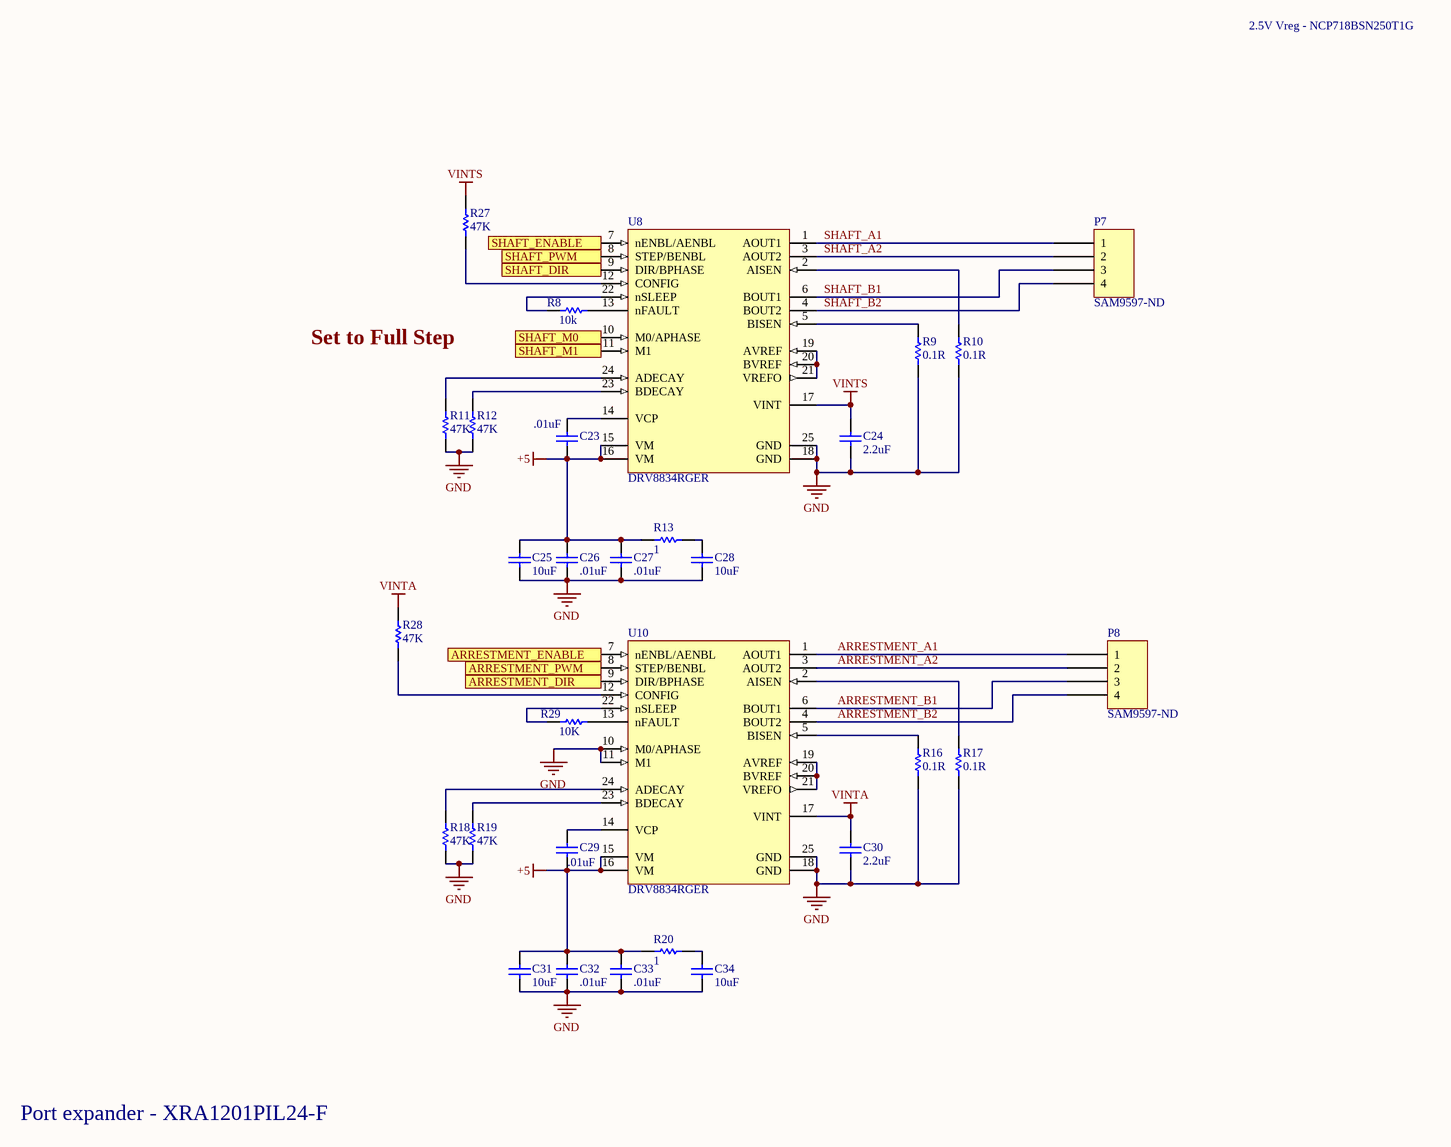
[diagram p5: Stepper Motor Driver.SchDoc]

### Parts
C23  .01uF  [CAPC0402(1005)60_N]
C24  2.2uF  [CAPC0402(1005)60_N]
C25  10uF  [CAPC0402(1005)60_N]
C26  .01uF  [CAPC0402(1005)60_N]
C27  .01uF  [CAPC0402(1005)60_N]
C28  10uF  [CAPC0402(1005)60_N]
C29  .01uF  [CAPC0402(1005)60_N]
C30  2.2uF  [CAPC0402(1005)60_N]
C31  10uF  [CAPC0402(1005)60_N]
C32  .01uF  [CAPC0402(1005)60_N]
C33  .01uF  [CAPC0402(1005)60_N]
C34  10uF  [CAPC0402(1005)60_N]
P7  Supplier Part Number 1: SAM9597-ND  [IPL1-104-01-L-S-RA-K]  (hidden comment: IPL1-104-01-L-S-RA-K)
P8  Supplier Part Number 1: SAM9597-ND  [IPL1-104-01-L-S-RA-K]  (hidden comment: IPL1-104-01-L-S-RA-K)
R8  10k  [RESC0402(1005)_M]
R9  0.1R  [RESC0402(1005)_M]
R10  0.1R  [RESC0402(1005)_M]
R11  47K  [RESC0402(1005)_M]
R12  47K  [RESC0402(1005)_M]
R13  1  [RESC0402(1005)_M]
R16  0.1R  [RESC0402(1005)_M]
R17  0.1R  [RESC0402(1005)_M]
R18  47K  [RESC0402(1005)_M]
R19  47K  [RESC0402(1005)_M]
R20  1  [RESC0402(1005)_M]
R27  47K  [RESC0402(1005)_M]
R28  47K  [RESC0402(1005)_M]
R29  10K  [RESC0402(1005)_M]
U8  DRV8834RGER  [RGE0024B_V]
U10  DRV8834RGER  [RGE0024B_V]

### Ports
ARRESTMENT_DIR, ARRESTMENT_ENABLE, ARRESTMENT_PWM, SHAFT_DIR, SHAFT_ENABLE, SHAFT_M0, SHAFT_M1, SHAFT_PWM

### Nets
+5: C23.1 C25.2 C26.2 C27.2 C29.1 C31.2 C32.2 C33.2 R13.1 R20.1 U8.15(VM) U8.16(VM) U10.15(VM) U10.16(VM)
GND: C24.1 C25.1 C26.1 C27.1 C28.1 C30.1 C31.1 C32.1 C33.1 C34.1 R9.2 R10.2 R11.2 R12.2 R16.2 R17.2 R18.2 R19.2 U8.18(GND) U8.25(GND) U10.10(M0/APHASE) U10.11(M1) U10.18(GND) U10.25(GND)
VINTA: C30.2 R28.1 U10.17(VINT)
VINTS: C24.2 R27.1 U8.17(VINT)
ARRESTMENT_A1: P8.1 U10.1(AOUT1)
ARRESTMENT_A2: P8.2 U10.3(AOUT2)
ARRESTMENT_B1: P8.3 U10.6(BOUT1)
ARRESTMENT_B2: P8.4 U10.4(BOUT2)
SHAFT_A1: P7.1 U8.1(AOUT1)
SHAFT_A2: P7.2 U8.3(AOUT2)
SHAFT_B1: P7.3 U8.6(BOUT1)
SHAFT_B2: P7.4 U8.4(BOUT2)
NetC23_2: C23.2 U8.14(VCP)
NetC28_2: C28.2 R13.2
NetC29_2: C29.2 U10.14(VCP)
NetC34_2: C34.2 R20.2
NetP5_1: U8.7(nENBL/AENBL) ; port SHAFT_ENABLE
NetP5_2: U8.8(STEP/BENBL) ; port SHAFT_PWM
NetP5_3: U8.9(DIR/BPHASE) ; port SHAFT_DIR
NetP5_4: U8.10(M0/APHASE) ; port SHAFT_M0
NetP5_5: U8.11(M1) ; port SHAFT_M1
NetP5_6: U10.7(nENBL/AENBL) ; port ARRESTMENT_ENABLE
NetP5_7: U10.8(STEP/BENBL) ; port ARRESTMENT_PWM
NetP5_8: U10.9(DIR/BPHASE) ; port ARRESTMENT_DIR
NetR8_1: R8.1 U8.22(nSLEEP)
NetR8_2: R8.2 U8.13(nFAULT)
NetR9_1: R9.1 U8.5(BISEN)
NetR10_1: R10.1 U8.2(AISEN)
NetR11_1: R11.1 U8.24(ADECAY)
NetR12_1: R12.1 U8.23(BDECAY)
NetR16_1: R16.1 U10.5(BISEN)
NetR17_1: R17.1 U10.2(AISEN)
NetR18_1: R18.1 U10.24(ADECAY)
NetR19_1: R19.1 U10.23(BDECAY)
NetR27_2: R27.2 U8.12(CONFIG)
NetR28_2: R28.2 U10.12(CONFIG)
NetR29_1: R29.1 U10.22(nSLEEP)
NetR29_2: R29.2 U10.13(nFAULT)
NetU8_19: U8.19(AVREF) U8.20(BVREF) U8.21(VREFO)
NetU10_19: U10.19(AVREF) U10.20(BVREF) U10.21(VREFO)

### Notes on the sheet
- 2.5V Vreg - NCP718BSN250T1G
- Set to Full Step
- Port expander - XRA1201PIL24-F
- Title
- Size:
- Date:
- Tabloid
- Number:
- Time:
- Revision:
- Sheet
- of
- ZLS Corporation
- 7801 North Lamar Blvd.
- Suite E-184
- Austin, Texas 78752  USA
- (512) 453-0288
- File:

### Library data of the parts
C23-C34 = CMP-1034-01365-1: CAP 220pF 25V ±10% 0402 (1005 Metric) Thickness 0.6mm SMD
R8-R13 R16-R20 R27-R29 = CMP-1011-00463-1
U8 U10 = CMP-1685-00004-1: Dual-Bridge Stepper or DC Motor Driver, 2.5 to 10.8 V, -40 to 85 degC, 24-pin QFN (RGE), Green (RoHS & no Sb/Br), Tape and Reel; Min Supply Voltage: 2.5 V; Output Current: 1.5 A; Nominal Supply Current: 4 mA; Max Operating Temperature: 85 degC; Pins: 24; Packaging: Tape and Reel; ComponentLink2Description: Datasheet; ComponentLink2URL: http://www.ti.com/general/docs/lit/getliterature.tsp?genericPartNumber=DRV8834&fileType=pdf; Mounting Technology: Surface Mount; ComponentLink1URL: http://www.ti.com/; Package Quantity: 3000; Mount: Surface Mount; Min Operating Temperature: -40 degC; RoHSCompliant: true; Radiation Hardening: No; PackageDescription: 24-Pin Quad Flat No-lead Package, Body 4 x 4 mm, Pitch 0.5 mm; DatasheetVersion: SLVSB19D, 03/2015; PackageReference: RGE0024B; ComponentLink1Description: Manufacturer URL
P7 P8 = IPL1-104-01-L-S-RA-K: Supplier 1: Digi-Key

## Nets that join several sheets
+3.3: Connectors (C3.2 U2.5), Power_Input_FET (R14.2), Bluetooth (5 pins)
+5: Connectors (C4.2 U2.1 U2.3), 5V_Supply_Alt_1 (7 pins), Stepper Motor Driver (14 pins)
GND: Connectors (C3.1 C4.1 U2.2), 12_Supply (79 pins), Power_Input_FET (7 pins), 5V_Supply_Alt_1 (8 pins), Bluetooth (P6.J2-1 P6.J2-2), Stepper Motor Driver (24 pins)
NetP5_1: Connectors (P5.1), Stepper Motor Driver (U8.7)
NetP5_2: Connectors (P5.2), Stepper Motor Driver (U8.8)
NetP5_3: Connectors (P5.3), Stepper Motor Driver (U8.9)
NetP5_4: Connectors (P5.4), Stepper Motor Driver (U8.10)
NetP5_5: Connectors (P5.5), Stepper Motor Driver (U8.11)
NetP5_6: Connectors (P5.6), Stepper Motor Driver (U10.7)
NetP5_7: Connectors (P5.7), Stepper Motor Driver (U10.8)
NetP5_8: Connectors (P5.8), Stepper Motor Driver (U10.9)
Power_IN: 12_Supply (11 pins), Power_Input_FET (F1.2), 5V_Supply_Alt_1 (C17.2 U4.8)
RS232_RX: Connectors (P9.1), Bluetooth (R25.1)
RS232_TX: Connectors (P9.3), Bluetooth (R26.1)